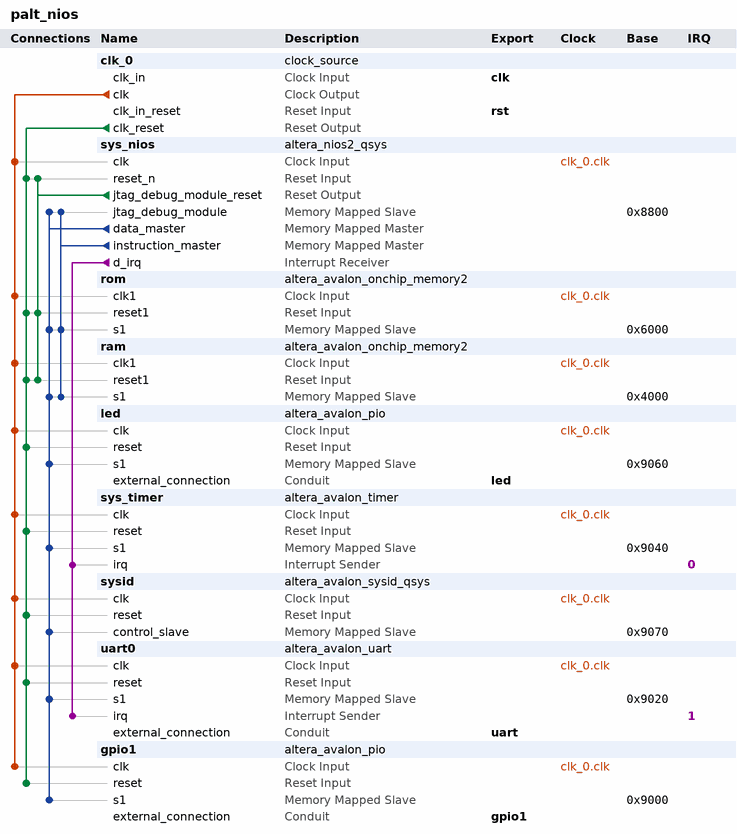
[diagram p0: system contents]
# Platform Designer (Qsys) system palt_nios, Cyclone IV E EP4CE6E22C8
# Parameters at their usual value, and those the tool derives, are not listed.
package require -exact qsys 13.1
create_system palt_nios
set_project_property DEVICE_FAMILY {Cyclone IV E}
set_project_property DEVICE EP4CE6E22C8

add_instance clk_0 clock_source 13.1
set_instance_parameter_value clk_0 clockFrequency 50000000

add_instance sys_nios altera_nios2_qsys 13.1
set_instance_parameter_value sys_nios resetSlave rom.s1
set_instance_parameter_value sys_nios mmu_TLBMissExcSlave None
set_instance_parameter_value sys_nios exceptionSlave ram.s1
set_instance_parameter_value sys_nios breakSlave sys_nios.jtag_debug_module
set_instance_parameter_value sys_nios impl Small
set_instance_parameter_value sys_nios icache_size 4096

add_instance rom altera_avalon_onchip_memory2 13.1
set_instance_parameter_value rom dataWidth 32
set_instance_parameter_value rom dualPort false
set_instance_parameter_value rom initMemContent true
set_instance_parameter_value rom initializationFileName onchip_mem.hex
set_instance_parameter_value rom memorySize 8192
set_instance_parameter_value rom writable false

add_instance ram altera_avalon_onchip_memory2 13.1
set_instance_parameter_value ram dataWidth 32
set_instance_parameter_value ram dualPort false
set_instance_parameter_value ram initMemContent true
set_instance_parameter_value ram initializationFileName onchip_mem.hex
set_instance_parameter_value ram memorySize 8192

add_instance led altera_avalon_pio 13.1
set_instance_parameter_value led direction Output
set_instance_parameter_value led resetValue 1
set_instance_parameter_value led width 1

add_instance sys_timer altera_avalon_timer 13.1
set_instance_parameter_value sys_timer fixedPeriod true
set_instance_parameter_value sys_timer period 1
set_instance_parameter_value sys_timer periodUnits MSEC
set_instance_parameter_value sys_timer snapshot false

add_instance sysid altera_avalon_sysid_qsys 13.1
set_instance_parameter_value sysid id 8

add_instance uart0 altera_avalon_uart 13.1
set_instance_parameter_value uart0 baud 9600
set_instance_parameter_value uart0 dataBits 8
set_instance_parameter_value uart0 fixedBaud true
set_instance_parameter_value uart0 parity NONE
set_instance_parameter_value uart0 stopBits 1

add_instance gpio1 altera_avalon_pio 13.1
set_instance_parameter_value gpio1 bitModifyingOutReg true
set_instance_parameter_value gpio1 direction Output
set_instance_parameter_value gpio1 width 2

# connections
add_connection clk_0.clk gpio1.clk clock
add_connection clk_0.clk led.clk clock
add_connection clk_0.clk ram.clk1 clock
add_connection clk_0.clk rom.clk1 clock
add_connection clk_0.clk sys_nios.clk clock
add_connection clk_0.clk sys_timer.clk clock
add_connection clk_0.clk sysid.clk clock
add_connection clk_0.clk uart0.clk clock
add_connection clk_0.clk_reset gpio1.reset reset
add_connection clk_0.clk_reset led.reset reset
add_connection clk_0.clk_reset ram.reset1 reset
add_connection clk_0.clk_reset rom.reset1 reset
add_connection clk_0.clk_reset sys_nios.reset_n reset
add_connection clk_0.clk_reset sys_timer.reset reset
add_connection clk_0.clk_reset sysid.reset reset
add_connection clk_0.clk_reset uart0.reset reset
add_connection sys_nios.jtag_debug_module_reset ram.reset1 reset
add_connection sys_nios.jtag_debug_module_reset rom.reset1 reset
add_connection sys_nios.jtag_debug_module_reset sys_nios.reset_n reset
add_connection sys_nios.data_master gpio1.s1 avalon
set_connection_parameter_value sys_nios.data_master/gpio1.s1 baseAddress 0x9000
add_connection sys_nios.data_master led.s1 avalon
set_connection_parameter_value sys_nios.data_master/led.s1 baseAddress 0x9060
add_connection sys_nios.data_master ram.s1 avalon
set_connection_parameter_value sys_nios.data_master/ram.s1 baseAddress 0x4000
add_connection sys_nios.data_master rom.s1 avalon
set_connection_parameter_value sys_nios.data_master/rom.s1 baseAddress 0x6000
add_connection sys_nios.data_master sys_nios.jtag_debug_module avalon
set_connection_parameter_value sys_nios.data_master/sys_nios.jtag_debug_module baseAddress 0x8800
add_connection sys_nios.data_master sys_timer.s1 avalon
set_connection_parameter_value sys_nios.data_master/sys_timer.s1 baseAddress 0x9040
add_connection sys_nios.data_master sysid.control_slave avalon
set_connection_parameter_value sys_nios.data_master/sysid.control_slave baseAddress 0x9070
add_connection sys_nios.data_master uart0.s1 avalon
set_connection_parameter_value sys_nios.data_master/uart0.s1 baseAddress 0x9020
add_connection sys_nios.instruction_master ram.s1 avalon
set_connection_parameter_value sys_nios.instruction_master/ram.s1 baseAddress 0x4000
add_connection sys_nios.instruction_master rom.s1 avalon
set_connection_parameter_value sys_nios.instruction_master/rom.s1 baseAddress 0x6000
add_connection sys_nios.instruction_master sys_nios.jtag_debug_module avalon
set_connection_parameter_value sys_nios.instruction_master/sys_nios.jtag_debug_module baseAddress 0x8800
add_connection sys_nios.d_irq sys_timer.irq interrupt
set_connection_parameter_value sys_nios.d_irq/sys_timer.irq irqNumber 0
add_connection sys_nios.d_irq uart0.irq interrupt
set_connection_parameter_value sys_nios.d_irq/uart0.irq irqNumber 1

# exported interfaces
add_interface clk clock sink
set_interface_property clk EXPORT_OF clk_0.clk_in
add_interface rst reset sink
set_interface_property rst EXPORT_OF clk_0.clk_in_reset
add_interface led conduit end
set_interface_property led EXPORT_OF led.external_connection
add_interface uart conduit end
set_interface_property uart EXPORT_OF uart0.external_connection
add_interface gpio1 conduit end
set_interface_property gpio1 EXPORT_OF gpio1.external_connection

set_interconnect_requirement {$system} qsys_mm.clockCrossingAdapter HANDSHAKE
set_interconnect_requirement {$system} qsys_mm.maxAdditionalLatency 1
set_interconnect_requirement {$system} qsys_mm.insertDefaultSlave false

save_system palt_nios.qsys
